# Altium schematic sheet TestPoints.SchDoc: param:Title
size A4; Author: param.Autor; Version: param:Version
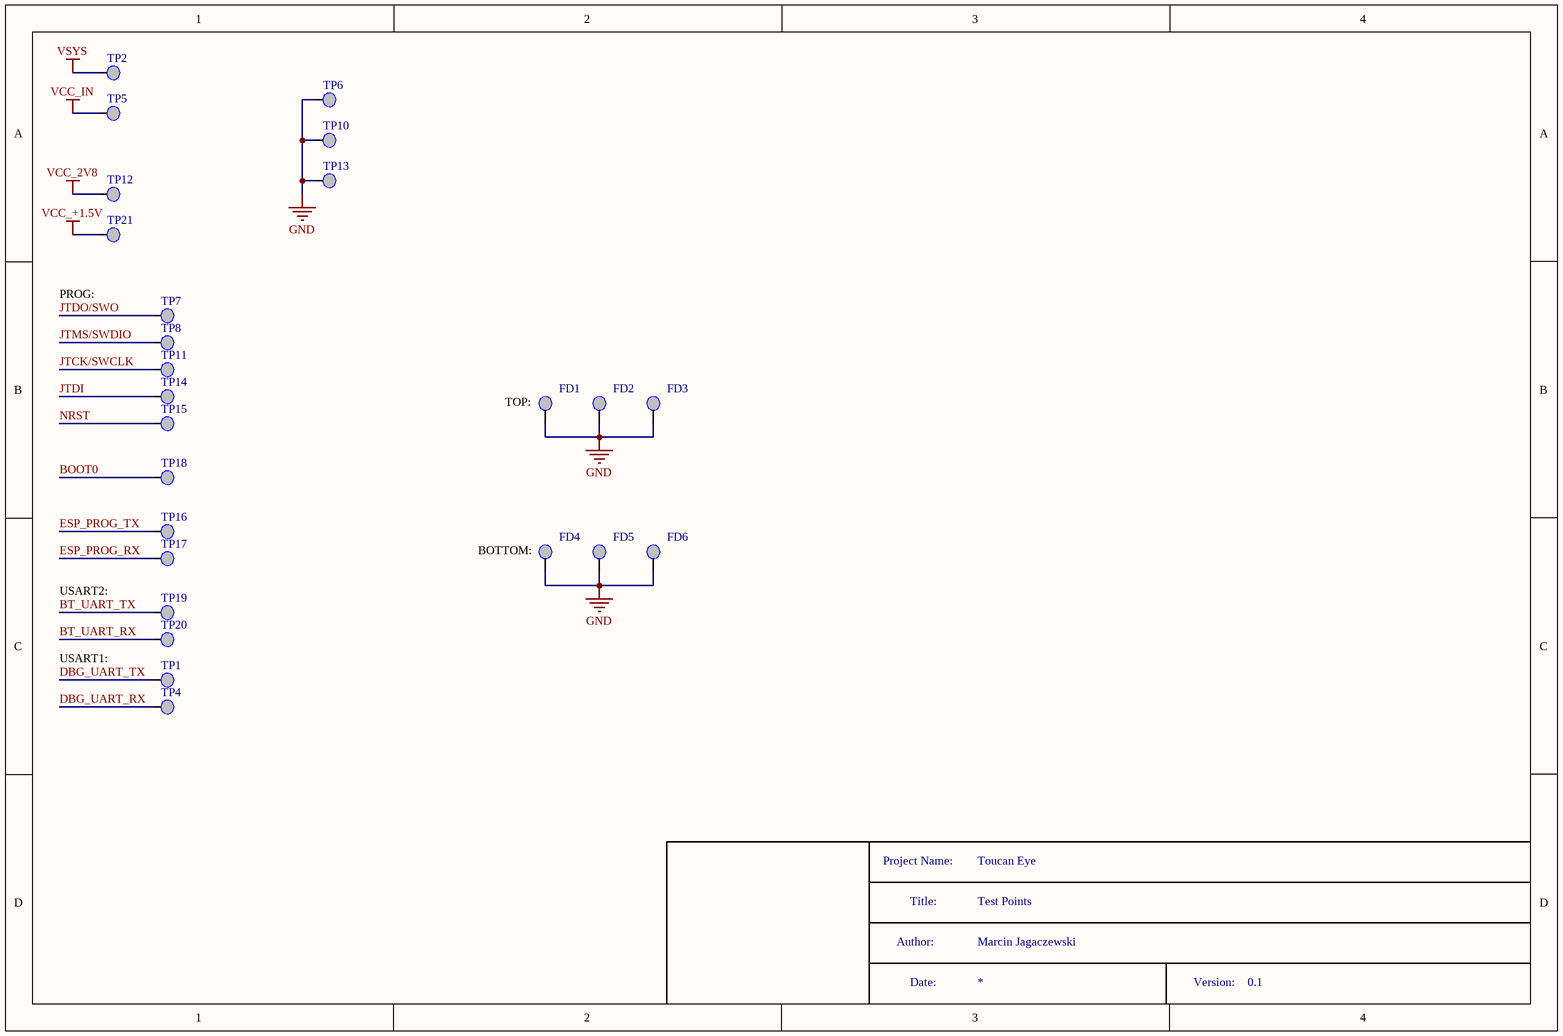
[diagram p0: TestPoints.SchDoc]

## Parts
FD1  Fiducial  [Fiducial]  (value not drawn)
FD2  Fiducial  [Fiducial]  (value not drawn)
FD3  Fiducial  [Fiducial]  (value not drawn)
FD4  Fiducial  [Fiducial]  (value not drawn)
FD5  Fiducial  [Fiducial]  (value not drawn)
FD6  Fiducial  [Fiducial]  (value not drawn)
TP1  Test_Point  [TP]  (value not drawn)  (no BOM)
TP2  Test_Point  [TP]  (value not drawn)  (no BOM)
TP4  Test_Point  [TP]  (value not drawn)  (no BOM)
TP5  Test_Point  [TP]  (value not drawn)  (no BOM)
TP6  Test_Point  [TP]  (value not drawn)  (no BOM)
TP7  Test_Point  [TP]  (value not drawn)  (no BOM)
TP8  Test_Point  [TP]  (value not drawn)  (no BOM)
TP10  Test_Point  [TP]  (value not drawn)  (no BOM)
TP11  Test_Point  [TP]  (value not drawn)  (no BOM)
TP12  Test_Point  [TP]  (value not drawn)  (no BOM)
TP13  Test_Point  [TP]  (value not drawn)  (no BOM)
TP14  Test_Point  [TP]  (value not drawn)  (no BOM)
TP15  Test_Point  [TP]  (value not drawn)  (no BOM)
TP16  Test_Point  [TP]  (value not drawn)  (no BOM)
TP17  Test_Point  [TP]  (value not drawn)  (no BOM)
TP18  Test_Point  [TP]  (value not drawn)  (no BOM)
TP19  Test_Point  [TP]  (value not drawn)  (no BOM)
TP20  Test_Point  [TP]  (value not drawn)  (no BOM)
TP21  Test_Point  [TP]  (value not drawn)  (no BOM)

## Nets
GND: FD1.1(GND) FD2.1(GND) FD3.1(GND) FD4.1(GND) FD5.1(GND) FD6.1(GND) TP6.1(TP) TP10.1(TP) TP13.1(TP)
VCC_2V8: TP12.1(TP)
VCC_+1.5V: TP21.1(TP)
VCC_IN: TP5.1(TP)
VSYS: TP2.1(TP)
BOOT0: TP18.1(TP)
BT_UART_RX: TP20.1(TP)
BT_UART_TX: TP19.1(TP)
DBG_UART_RX: TP4.1(TP)
DBG_UART_TX: TP1.1(TP)
ESP_PROG_RX: TP17.1(TP)
ESP_PROG_TX: TP16.1(TP)
JTCK/SWCLK: TP11.1(TP)
JTDI: TP14.1(TP)
JTDO/SWO: TP7.1(TP)
JTMS/SWDIO: TP8.1(TP)
NRST: TP15.1(TP)

## Notes on the sheet
- PROG:
- (near FD1) TOP:
- (near FD4) BOTTOM:
- USART2:
- USART1:
- Project Name:
- Title:
- Test Points
- Toucan Eye
- Author:
- Date:
- Marcin Jagaczewski
- Version:
- 0.1

## Library data of the parts
FD1-FD6 = Fiducial: SCHChecked: 1; PCBChecked: 1
TP1 TP2 TP4-TP8 TP10-TP21 = Test_Point: *SCHChecked: 1; *PCBChecked: 1